# EAGLE design main (EAGLE 8.2.1)
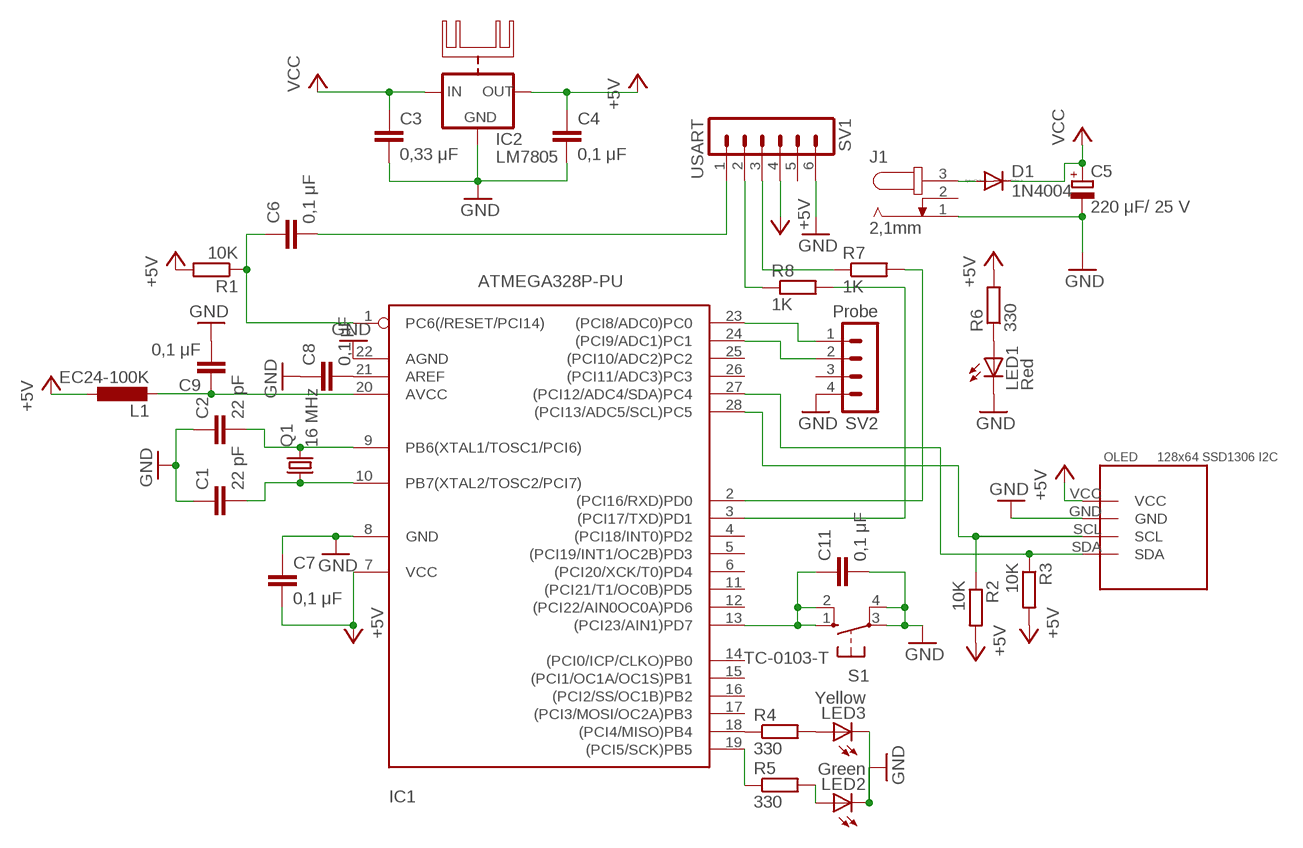
[diagram p0: schematic, sheet 1]

## Parts
C1  22 pF  C-EU025-025X050  [C025-025X050]
C2  22 pF  C-EU025-025X050  [C025-025X050]
C3  0,33 μF  C-EU050-025X075  [C050-025X075]
C4  0,1 μF  C-EU050-025X075  [C050-025X075]
C5  220 μF/ 25 V  CPOL-EUE5-8.5  [E5-8,5]
C6  0,1 μF  C-EU050-025X075  [C050-025X075]
C7  0,1 μF  C-EU050-025X075  [C050-025X075]
C8  0,1 μF  C-EU050-025X075  [C050-025X075]
C9  0,1 μF  C-EU050-025X075  [C050-025X075]
C11  0,1 μF  C-EU050-025X075  [C050-025X075]
D1  1N4004  [DO41-10]
IC1  ATMEGA328P-PU  ATMEGA328-20P  [DIL28-3]
IC2  LM7805  78XXH  [78XXH]
J1  2,1mm  JACK-PLUG0  [SPC4077]
L1  EC24-100K  L-EU0207/12  [0207/12]
LED1  Red  LED5MM  [LED5MM]
LED2  Green  LED5MM  [LED5MM]
LED3  Yellow  LED5MM  [LED5MM]
OLED  128x64 SSD1306 I2C  OLED_0.96_I2C  [OLED_0.96_I2C]
Q1  16 MHz  CRYSTALHC49S  [HC49/S]
R1  10K  R-EU_0207/7  [0207/7]
R2  10K  R-EU_0207/7  [0207/7]
R3  10K  R-EU_0207/7  [0207/7]
R4  330  R-EU_0207/7  [0207/7]
R5  330  R-EU_0207/7  [0207/7]
R6  330  R-EU_0207/7  [0207/7]
R7  1K  R-EU_0207/7  [0207/7]
R8  1K  R-EU_0207/7  [0207/7]
S1  TC-0103-T  10-XX  [B3F-10XX]
SV1  USART  MA06-1  [MA06-1]
SV2  Probe  MA04-1  [MA04-1]

## Nets
+5V: C4.1 C7.2 IC1.7(VCC) IC2.OUT L1.1 OLED.VCC R1.2 R2.2 R3.2 R6.2 SV1.4
BTN: C11.1 IC1.13((PCI23/AIN1)PD7) S1.1(S) S1.2(S1)
GND: C1.1 C2.1 C3.2 C4.2 C5.- C7.1 C8.1 C9.2 C11.2 IC1.8(GND) IC1.22(AGND) IC2.GND J1.1 LED1.K(C) LED2.K(C) LED3.K(C) OLED.GND S1.3(P) S1.4(P1) SV1.6 SV2.4
IJVCC: D1.A J1.3
N$1: C1.2 IC1.10(PB7(XTAL2/TOSC2/PCI7)) Q1.1
N$2: C2.2 IC1.9(PB6(XTAL1/TOSC1/PCI6)) Q1.2
N$3: IC1.27((PCI12/ADC4/SDA)PC4) OLED.SDA R3.1
N$5: C6.1 IC1.1(PC6(/RESET/PCI14)) R1.1
N$7: C6.2 SV1.1
N$8: IC1.2((PCI16/RXD)PD0) R7.2
N$9: IC1.3((PCI17/TXD)PD1) R8.2
N$10: IC1.23((PCI8/ADC0)PC0) SV2.1
N$11: IC1.24((PCI9/ADC1)PC1) SV2.2
N$12: C8.2 IC1.21(AREF)
N$14: IC1.18((PCI4/MISO)PB4) R4.1
N$16: IC1.19((PCI5/SCK)PB5) R5.1
N$17: LED3.A R4.2
N$18: C9.1 IC1.20(AVCC) L1.2
N$19: LED2.A R5.2
N$20: LED1.A R6.1
N$21: R8.1 SV1.2
N$22: R7.1 SV1.3
SCL: IC1.28((PCI13/ADC5/SCL)PC5) OLED.SCL R2.1
VCC: C3.1 C5.+ D1.C IC2.IN
Unconnected: IC1.4((PCI18/INT0)PD2) IC1.5((PCI19/INT1/OC2B)PD3) IC1.6((PCI20/XCK/T0)PD4) IC1.11((PCI21/T1/OC0B)PD5) IC1.12((PCI22/AIN0OC0A)PD6) IC1.14((PCI0/ICP/CLKO)PB0) IC1.15((PCI1/OC1A/OC1S)PB1) IC1.16((PCI2/SS/OC1B)PB2) IC1.17((PCI3/MOSI/OC2A)PB3) IC1.25((PCI10/ADC2)PC2) IC1.26((PCI11/ADC3)PC3) J1.2 SV1.5 SV2.3

## Library data of the parts
C1-C4 C6-C9 C11 = rcl:C-EU: CAPACITOR, European symbol
C5 = rcl:CPOL-EU: POLARIZED CAPACITOR, European symbol
D1 = diode:1N4004: DIODE general purpose rectifier, 1 A
IC1 = atmega328:ATMEGA328*P: MICROCONTROLLER 32 kBytes FLASH 2 kBytes SRAM 1 kBytes EEPROM USART 8-channel 10 bit ADC
IC2 = 78xx_with_heatsink:78XXH: VOLTAGE REGULATOR
J1 = con-jack:JACK-PLUG: DC POWER JACK Power Jack, DC, Right Angle, Through Hole, Rated 5A at 16VDC, PC Terminals Distributor: Farnell (www.Farnell.de) Drawing: 84N1161.pdf / 84N1162.pdf Manufacturer: SPC Technology (www.spctechnology.com) Type: SPC4077 / SPC 4078; OC_FARNELL: unknown; OC_NEWARK: unknown
L1 = rcl:L-EU: INDUCTOR, European symbol
LED1-LED3 = led:LED: LED OSRAM: - CHIPLED LG R971, LG N971, LY N971, LG Q971, LY Q971, LO R971, LY R971 LH N974, LH R974 LS Q976, LO Q976, LY Q976 LO Q996 - Hyper CHIPLED LW Q18S LB Q993, LB Q99A, LB R99A - SideLED LS A670, LO A670, LY A670, LG A670, LP A670 LB A673, LV A673, LT A673, LW A673 LH A674 LY A675 LS A676, LA A676, LO A676, LY A676, LW A676 LS A679, LY A679, LG A679 - Hyper Micro SIDELED® LS Y876, LA Y876, LO Y876, LY Y876 LT Y87S - SmartLED LW L88C, LW L88S LB L89C, LB L89S, LG L890 LS L89K, LO L89K, LY L89K LS L896, LA L896, LO L896, LY L896 - TOPLED LS T670, LO T670, LY T670, LG T670, LP T670 LSG T670, LSP T670, LSY T670, LOP T670, LYG T670 LG T671, LOG T671, LSG T671 LB T673, LV T673, LT T673, LW T673 LH T674 LS T676, LA T676, LO T676, LY T676, LB T676, LH T676, LSB T676, LW T676 LB T67C, LV T67C, LT T67C, LS T67K, LO T67K, LY T67K, LW E67C LS E67B, LA E67B, LO E67B, LY E67B, LB E67C, LV E67C, LT E67C LW T67C LS T679, LY T679, LG T679 LS T770, LO T770, LY T770, LG T770, LP T770 LB T773, LV T773, LT T773, LW T773 LH T774 LS E675, LA E675, LY E675, LS T675 LS T776, LA T776, LO T776, LY T776, LB T776 LHGB T686 LT T68C, LB T68C - Hyper Mini TOPLED® LB M676 - Mini TOPLED Santana® LG M470 LS M47K, LO M47K, LY M47K Source: http://www.osram.convergy.de LUXEON: - LUMILED® LXK2-PW12-R00, LXK2-PW12-S00, LXK2-PW14-U00, LXK2-PW14-V00 LXK2-PM12-R00, LXK2-PM12-S00, LXK2-PM14-U00 LXK2-PE12-Q00, LXK2-PE12-R00, LXK2-PE12-S00, LXK2-PE14-T00, LXK2-PE14-U00 LXK2-PB12-K00, LXK2-PB12-L00, LXK2-PB12-M00, LXK2-PB14-N00, LXK2-PB14-P00, LXK2-PB14-Q00 LXK2-PR12-L00, LXK2-PR12-M00, LXK2-PR14-Q00, LXK2-PR14-R00 LXK2-PD12-Q00, LXK2-PD12-R00, LXK2-PD12-S00 LXK2-PH12-R00, LXK2-PH12-S00 LXK2-PL12-P00, LXK2-PL12-Q00, LXK2-PL12-R00 Source: www.luxeon.com KINGBRIGHT: KA-3528ASYC Source: www.kingbright.com
OLED = tft_1.8_1.44_oled_0.96:OLED_0.96_I2C
Q1 = crystal:CRYSTAL: CRYSTAL; OC_FARNELL: 1667008; OC_NEWARK: unknown
R1-R8 = rcl:R-EU_: RESISTOR, European symbol
S1 = switch-omron:10-XX: OMRON SWITCH; MPN: B3F-1000; OC_FARNELL: 176432; OC_NEWARK: 36M3542
SV1 = con-lstb:MA06-1: PIN HEADER; OC_FARNELL: unknown; OC_NEWARK: unknown
SV2 = con-lstb:MA04-1: PIN HEADER; OC_FARNELL: unknown; OC_NEWARK: unknown

## Board
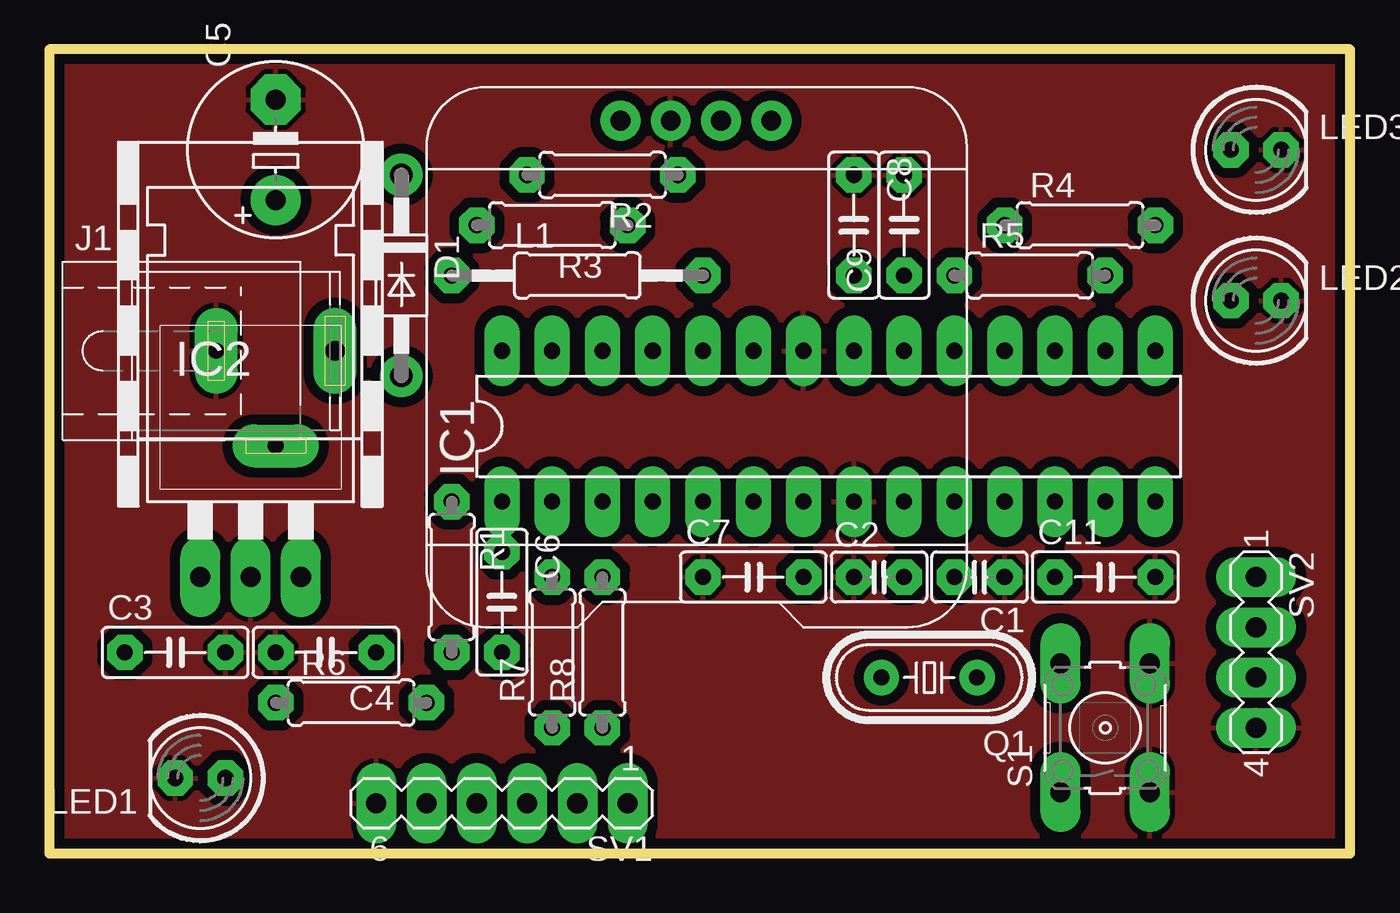
[diagram p1: board, top side]
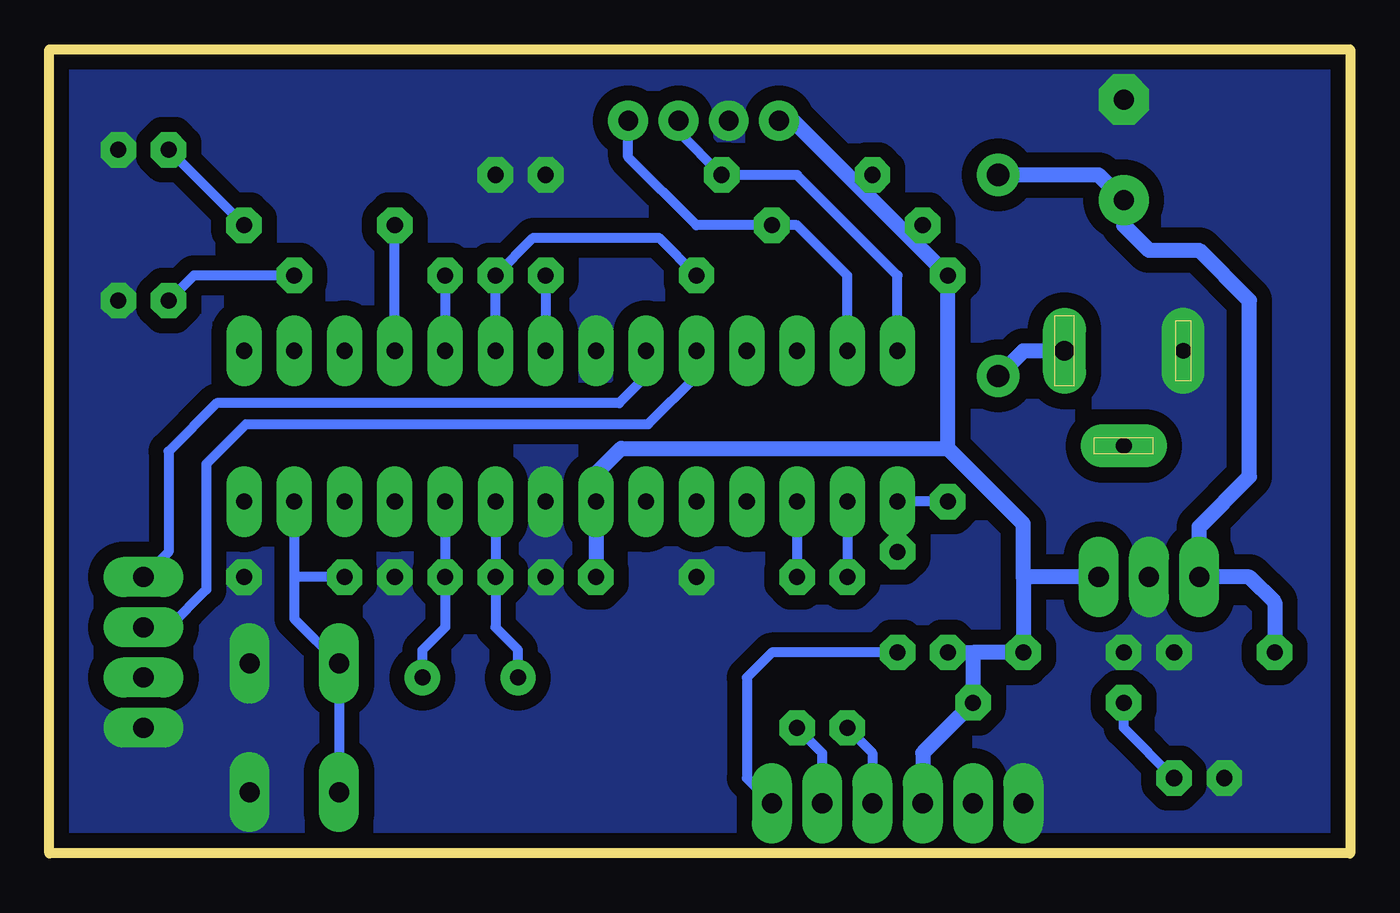
[diagram p2: board, bottom side, seen from below]

Size 65.71 x 40.63 mm. Coordinates in mm from the lower left corner, seen from the top.
Outline: 0,0 65.71,0 65.71,40.63 0,40.63 0,0
Copper layers (1*16): Top 0.035mm / dielectric 1.5mm / Bottom 0.035mm
Design rules "default *": minimum track width 20mil, minimum drill 0.8mm, track to track 20mil, track to pad 20mil, pad to pad 20mil, via to via 20mil, smd to smd 6mil, copper to edge 20mil, drill to drill 6mil, minimum pad ring 10mil, minimum via ring 8mil, stop-mask expansion 4mil, vias tented up to drill 0mil, thermal gap 10mil

### Footprints (pad centres in the part's own frame; a part is rotated, then mirrored left to right if it is on the bottom)
C025-025X050 = drill 0.813 octagon: 1 -1.27,0; 2 1.27,0
C050-025X075 = drill 0.813 octagon: 1 -2.54,0; 2 2.54,0
E5-8,5 = drill 1.016 pad 2.54: + -2.54,0 | drill 1.016 pad 2.54 octagon: - 2.54,0
DO41-10 = drill 1.118: A 5.08,0; C -5.08,0
DIL28-3 = drill 0.813 long: 1 -16.51,-3.81; 2 -13.97,-3.81; 3 -11.43,-3.81; 4 -8.89,-3.81; 5 -6.35,-3.81; 6 -3.81,-3.81; 7 -1.27,-3.81; 8 1.27,-3.81; 9 3.81,-3.81; 10 6.35,-3.81; 11 8.89,-3.81; 12 11.43,-3.81; 13 13.97,-3.81; 14 16.51,-3.81; 15 16.51,3.81; 16 13.97,3.81; 17 11.43,3.81; 18 8.89,3.81; 19 6.35,3.81; 20 3.81,3.81; 21 1.27,3.81; 22 -1.27,3.81; 23 -3.81,3.81; 24 -6.35,3.81; 25 -8.89,3.81; 26 -11.43,3.81; 27 -13.97,3.81; 28 -16.51,3.81
78XXH = drill 1.016 long: GND 0,-5.08; IN -2.54,-5.08; OUT 2.54,-5.08
SPC4077 = drill 0.8 pad 2.184 long: 1 -3,0; 2 0,-4.8 | drill 1 pad 2.184 long: 3 3,0
0207/12 = drill 0.813 octagon: 1 -6.35,0; 2 6.35,0
LED5MM = drill 0.813 octagon: A -1.27,0; K 1.27,0
OLED_0.96_I2C = drill 1 pad 1.778: GND -1.63,11.63; SCL 0.91,11.63; SDA 3.45,11.63; VCC -4.17,11.63
HC49/S = drill 0.813: 1 -2.413,0; 2 2.413,0
0207/7 = drill 0.813 octagon: 1 -3.81,0; 2 3.81,0
B3F-10XX = drill 1.016 long: 1 -3.251,2.261; 2 3.251,2.261; 3 -3.251,-2.261; 4 3.251,-2.261
MA06-1 = drill 1.016 long: 1 -6.35,0; 2 -3.81,0; 3 -1.27,0; 4 1.27,0; 5 3.81,0; 6 6.35,0
MA04-1 = drill 1.016 long: 1 -3.81,0; 2 -1.27,0; 3 1.27,0; 4 3.81,0

### Placement (x,y rotation side)
C1  46.99,13.97 180 top
C2  41.91,13.97 0 top
C3  6.35,10.16 0 top
C4  13.97,10.16 180 top
C5  11.43,35.56 90 top
C6  22.86,12.7 270 top
C7  35.56,13.97 0 top
C8  40.64,31.75 270 top
C9  43.18,31.75 90 top
C11  53.34,13.97 0 top
D1  17.78,29.21 270 top
IC1  39.37,21.59 0 top
IC2  10.16,19.05 0 top
J1  11.43,25.4 0 top
L1  26.67,29.21 0 top
LED1  7.62,3.81 180 top
LED2  60.96,27.94 0 top
LED3  60.96,35.56 0 top
OLED  33.02,25.4 0 top
Q1  44.45,8.89 180 top
R1  20.32,13.97 270 top
R2  27.94,34.29 180 top
R3  25.4,31.75 180 top
R4  52.07,31.75 0 top
R5  49.53,29.21 0 top
R6  15.24,7.62 0 top
R7  25.4,10.16 90 top
R8  27.94,10.16 90 top
S1  53.34,6.35 90 top
SV1  22.86,2.54 180 top
SV2  60.96,10.16 270 top

### Tracks (layer width: path | path; a pad name or v marks a point on that pad's centre or on a via)
+5V
  Bottom 0.762: 19.05,10.16 R6.2 21.59,5.08 SV1.4 | IC2.OUT 16.51,13.97 | 20.32,20.47 L1.1 22.23,31.11 | 20.32,20.47 36.83,20.47 38.1,19.2 IC1.7 | 16.51,13.97 C4.1 19.05,10.16 | 38.1,19.05 IC1.7 | IC1.7 C7.2 | R1.2 19.05,10.16 | 22.23,31.11 24.77,33.66 | 24.77,33.66 28.14,37.03 OLED.VCC | R2.2 24.77,33.66 | R3.2 22.23,31.11 | 16.51,13.97 16.51,16.51 16.51,16.66 20.32,20.47 | IC1.7 38.1,17.7 37.9,17.5
BTN
  Bottom 0.508: S1.1 S1.2 53.34,11.86 53.34,13.97 | IC1.13 53.34,13.97 | C11.1 53.34,13.97
GND
  pour Bottom (isolate 0.762, no thermals): 0,0 65.71,0 65.71,40.64 0,40.64
  pour Top: 0,40.64 65.71,40.64 65.71,0 0,0
IJVCC
  Bottom 0.762: J1.3 16.51,25.4 D1.A
N$1
  Bottom 0.508: 46.99,8.89 Q1.1 46.86,10.29 45.72,11.43 C1.2 IC1.10
N$2
  Bottom 0.508: Q1.2 42.04,10.29 43.18,11.43 C2.2 IC1.9
N$3
  Bottom 0.508: IC1.27 25.4,29.21 27.94,31.75 R3.1 33.02,31.75 36.47,35.2 OLED.SDA
N$5
  Bottom 0.508: R1.1 IC1.1 C6.1
N$7
  Bottom 0.508: C6.2 29.21,10.16 30.48,8.89 30.48,3.81 SV1.1
N$8
  Bottom 0.508: 25.4,16.51 IC1.2 R7.2
N$9
  Bottom 0.508: IC1.3 R8.2
N$10
  Bottom 0.508: SV2.1 59.69,15.24 59.69,20.32 57.25,22.76 36.93,22.76 35.56,24.13 IC1.23
N$11
  Bottom 0.508: IC1.24 33.02,24.13 35.46,21.69 55.78,21.69 57.78,19.68 57.78,13.34 59.69,11.43 SV2.2
N$12
  Bottom 0.508: C8.2 IC1.21
N$14
  Bottom 0.508: IC1.18 R4.1
N$16
  Bottom 0.508: R5.1 IC1.19
N$17
  Bottom 0.508: R4.2 LED3.A
N$18
  Bottom 0.508: IC1.20 C9.1 41.27,31.11 34.92,31.11 L1.2
N$19
  Bottom 0.508: R5.2 58.42,29.21 LED2.A
N$20
  Bottom 0.508: LED1.A 11.43,6.35 R6.1
N$21
  Bottom 0.508: R8.1 26.67,5.08 SV1.2
N$22
  Bottom 0.508: R7.1 24.13,5.08 SV1.3
SCL
  Bottom 0.508: IC1.28 22.86,29.21 27.94,34.29 R2.1 33.93,36.47 OLED.SCL
VCC
  Bottom 0.762: C3.1 3.81,12.7 5.08,13.97 IC2.IN 7.62,16.51 5.08,19.05 5.08,27.94 7.62,30.48 10.16,30.48 11.43,31.75 C5.+ 12.7,34.29 D1.C